# Altium schematic sheet [1] COVER PAGE.SchDoc
size Letter; Author: Ángel O. , Victor V.; DocumentNumber: 1; Revision: 1.0; SheetNumber: 1; SheetTotal: 6
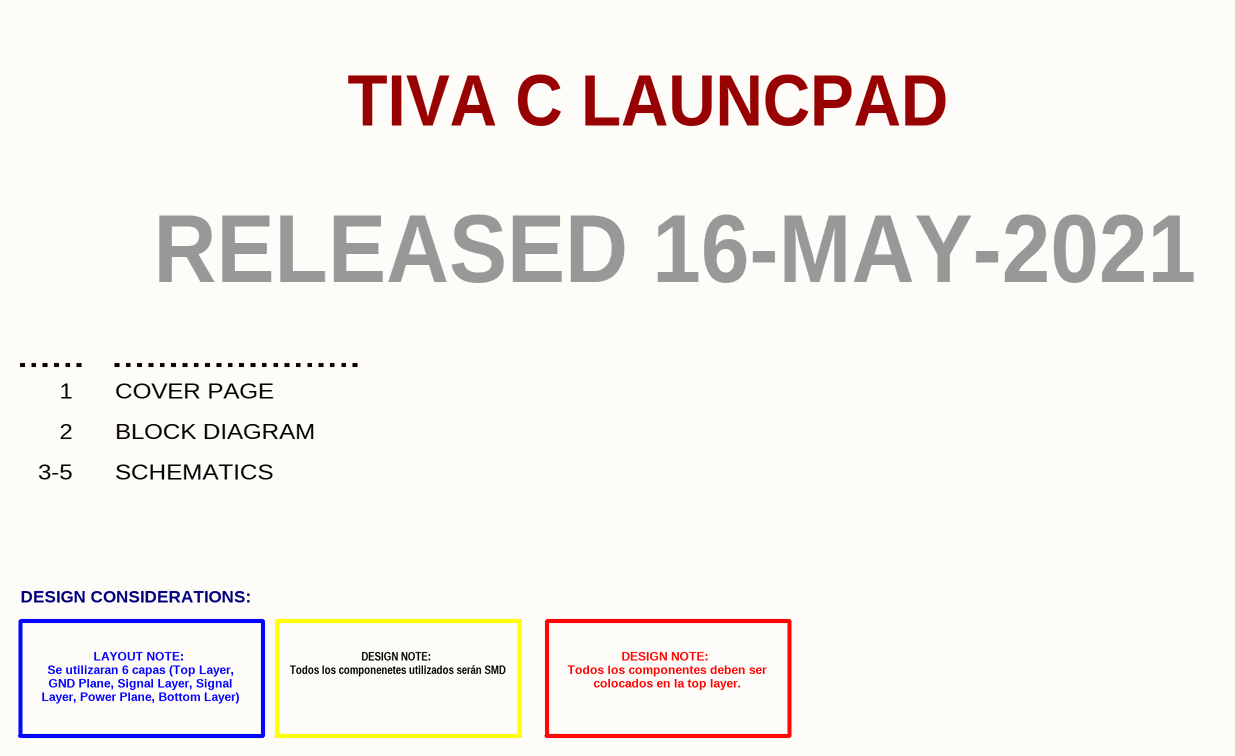
[diagram p0: [1] COVER PAGE.SchDoc]

## Notes on the sheet
- TIVA C LAUNCPAD
- RELEASED 16-MAY-2021
- 1
- COVER PAGE
- 2
- 3-5
- BLOCK DIAGRAM
- SCHEMATICS
- DESIGN CONSIDERATIONS:
- DESIGN NOTE:
  Todos los componenetes utilizados serán SMD
- DESIGN NOTE:
  Todos los componentes deben ser colocados en la top layer.
- LAYOUT NOTE:
  Se utilizaran 6 capas (Top Layer, GND Plane, Signal Layer, Signal Layer, Power Plane, Bottom Layer)
- Project:
- Page Content:
- Revisión:
- Size:
- Letter
- Design:
- Document Number:
- Date:
- Sheet:
- of